# EAGLE design placa para insolar joystick (EAGLE 7.3.0)
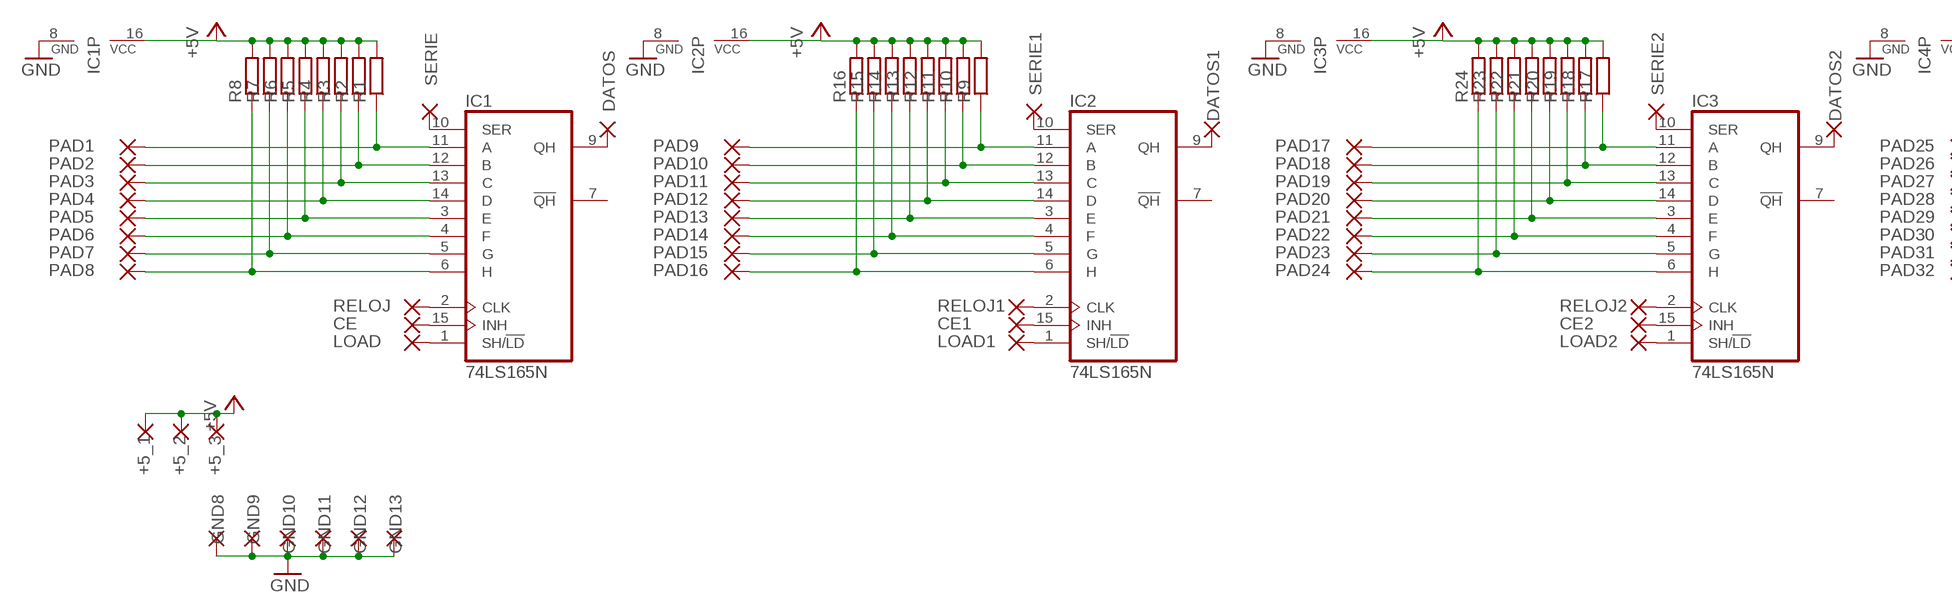
[diagram p0: schematic, sheet 1, part 1 of 2]
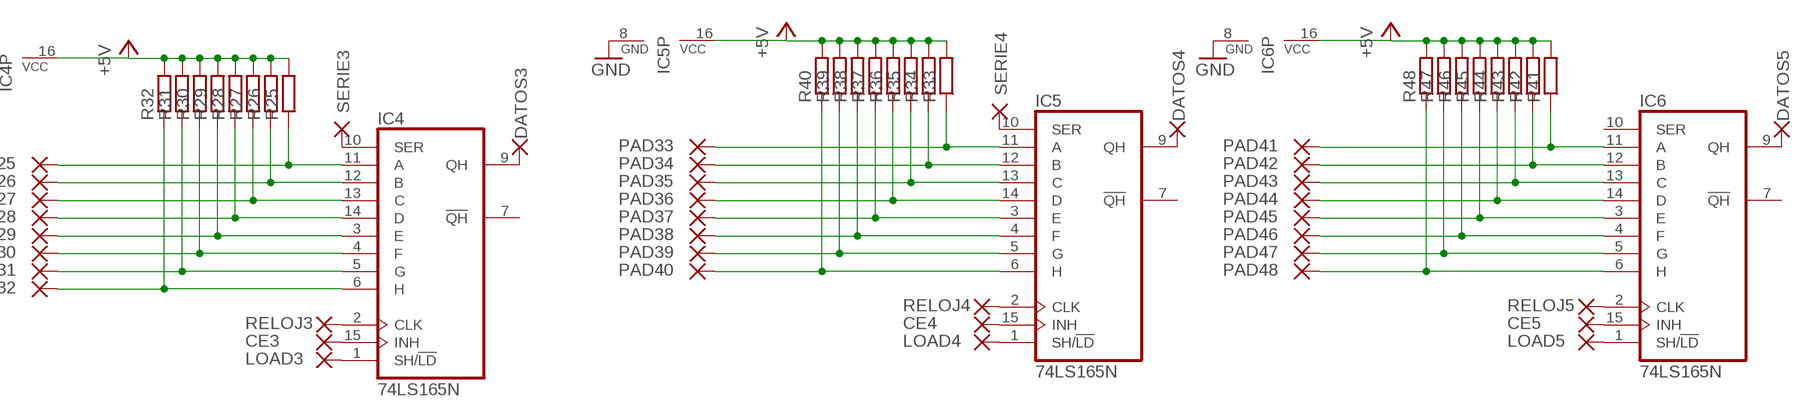
[diagram p1: schematic, sheet 1, part 2 of 2]

## Parts
+5_1  WIREPAD2,54/1,0  [2,54/1,0]
+5_2  WIREPAD2,54/1,0  [2,54/1,0]
+5_3  WIREPAD2,54/1,0  [2,54/1,0]
CE  WIREPAD2,54/1,0  [2,54/1,0]
CE1  WIREPAD2,54/1,0  [2,54/1,0]
CE2  WIREPAD2,54/1,0  [2,54/1,0]
CE3  WIREPAD2,54/1,0  [2,54/1,0]
CE4  WIREPAD2,54/1,0  [2,54/1,0]
CE5  WIREPAD2,54/1,0  [2,54/1,0]
DATOS  WIREPAD2,54/1,0  [2,54/1,0]
DATOS1  WIREPAD2,54/1,0  [2,54/1,0]
DATOS2  WIREPAD2,54/1,0  [2,54/1,0]
DATOS3  WIREPAD2,54/1,0  [2,54/1,0]
DATOS4  WIREPAD2,54/1,0  [2,54/1,0]
DATOS5  WIREPAD2,54/1,0  [2,54/1,0]
GND8  WIREPAD2,54/1,0  [2,54/1,0]
GND9  WIREPAD2,54/1,0  [2,54/1,0]
GND10  WIREPAD2,54/1,0  [2,54/1,0]
GND11  WIREPAD2,54/1,0  [2,54/1,0]
GND12  WIREPAD2,54/1,0  [2,54/1,0]
GND13  WIREPAD2,54/1,0  [2,54/1,0]
IC1  74LS165N  [DIL16]
IC2  74LS165N  [DIL16]
IC3  74LS165N  [DIL16]
IC4  74LS165N  [DIL16]
IC5  74LS165N  [DIL16]
IC6  74LS165N  [DIL16]
LOAD  WIREPAD2,54/1,0  [2,54/1,0]
LOAD1  WIREPAD2,54/1,0  [2,54/1,0]
LOAD2  WIREPAD2,54/1,0  [2,54/1,0]
LOAD3  WIREPAD2,54/1,0  [2,54/1,0]
LOAD4  WIREPAD2,54/1,0  [2,54/1,0]
LOAD5  WIREPAD2,54/1,0  [2,54/1,0]
PAD1  WIREPAD2,54/1,0  [2,54/1,0]
PAD2  WIREPAD2,54/1,0  [2,54/1,0]
PAD3  WIREPAD2,54/1,0  [2,54/1,0]
PAD4  WIREPAD2,54/1,0  [2,54/1,0]
PAD5  WIREPAD2,54/1,0  [2,54/1,0]
PAD6  WIREPAD2,54/1,0  [2,54/1,0]
PAD7  WIREPAD2,54/1,0  [2,54/1,0]
PAD8  WIREPAD2,54/1,0  [2,54/1,0]
PAD9  WIREPAD2,54/1,0  [2,54/1,0]
PAD10  WIREPAD2,54/1,0  [2,54/1,0]
PAD11  WIREPAD2,54/1,0  [2,54/1,0]
PAD12  WIREPAD2,54/1,0  [2,54/1,0]
PAD13  WIREPAD2,54/1,0  [2,54/1,0]
PAD14  WIREPAD2,54/1,0  [2,54/1,0]
PAD15  WIREPAD2,54/1,0  [2,54/1,0]
PAD16  WIREPAD2,54/1,0  [2,54/1,0]
PAD17  WIREPAD2,54/1,0  [2,54/1,0]
PAD18  WIREPAD2,54/1,0  [2,54/1,0]
PAD19  WIREPAD2,54/1,0  [2,54/1,0]
PAD20  WIREPAD2,54/1,0  [2,54/1,0]
PAD21  WIREPAD2,54/1,0  [2,54/1,0]
PAD22  WIREPAD2,54/1,0  [2,54/1,0]
PAD23  WIREPAD2,54/1,0  [2,54/1,0]
PAD24  WIREPAD2,54/1,0  [2,54/1,0]
PAD25  WIREPAD2,54/1,0  [2,54/1,0]
PAD26  WIREPAD2,54/1,0  [2,54/1,0]
PAD27  WIREPAD2,54/1,0  [2,54/1,0]
PAD28  WIREPAD2,54/1,0  [2,54/1,0]
PAD29  WIREPAD2,54/1,0  [2,54/1,0]
PAD30  WIREPAD2,54/1,0  [2,54/1,0]
PAD31  WIREPAD2,54/1,0  [2,54/1,0]
PAD32  WIREPAD2,54/1,0  [2,54/1,0]
PAD33  WIREPAD2,54/1,0  [2,54/1,0]
PAD34  WIREPAD2,54/1,0  [2,54/1,0]
PAD35  WIREPAD2,54/1,0  [2,54/1,0]
PAD36  WIREPAD2,54/1,0  [2,54/1,0]
PAD37  WIREPAD2,54/1,0  [2,54/1,0]
PAD38  WIREPAD2,54/1,0  [2,54/1,0]
PAD39  WIREPAD2,54/1,0  [2,54/1,0]
PAD40  WIREPAD2,54/1,0  [2,54/1,0]
PAD41  WIREPAD2,54/1,0  [2,54/1,0]
PAD42  WIREPAD2,54/1,0  [2,54/1,0]
PAD43  WIREPAD2,54/1,0  [2,54/1,0]
PAD44  WIREPAD2,54/1,0  [2,54/1,0]
PAD45  WIREPAD2,54/1,0  [2,54/1,0]
PAD46  WIREPAD2,54/1,0  [2,54/1,0]
PAD47  WIREPAD2,54/1,0  [2,54/1,0]
PAD48  WIREPAD2,54/1,0  [2,54/1,0]
R1  R-EU_0204/7  [0204/7]
R2  R-EU_0204/7  [0204/7]
R3  R-EU_0204/7  [0204/7]
R4  R-EU_0204/7  [0204/7]
R5  R-EU_0204/7  [0204/7]
R6  R-EU_0204/7  [0204/7]
R7  R-EU_0204/7  [0204/7]
R8  R-EU_0204/7  [0204/7]
R9  R-EU_0204/7  [0204/7]
R10  R-EU_0204/7  [0204/7]
R11  R-EU_0204/7  [0204/7]
R12  R-EU_0204/7  [0204/7]
R13  R-EU_0204/7  [0204/7]
R14  R-EU_0204/7  [0204/7]
R15  R-EU_0204/7  [0204/7]
R16  R-EU_0204/7  [0204/7]
R17  R-EU_0204/7  [0204/7]
R18  R-EU_0204/7  [0204/7]
R19  R-EU_0204/7  [0204/7]
R20  R-EU_0204/7  [0204/7]
R21  R-EU_0204/7  [0204/7]
R22  R-EU_0204/7  [0204/7]
R23  R-EU_0204/7  [0204/7]
R24  R-EU_0204/7  [0204/7]
R25  R-EU_0204/7  [0204/7]
R26  R-EU_0204/7  [0204/7]
R27  R-EU_0204/7  [0204/7]
R28  R-EU_0204/7  [0204/7]
R29  R-EU_0204/7  [0204/7]
R30  R-EU_0204/7  [0204/7]
R31  R-EU_0204/7  [0204/7]
R32  R-EU_0204/7  [0204/7]
R33  R-EU_0204/7  [0204/7]
R34  R-EU_0204/7  [0204/7]
R35  R-EU_0204/7  [0204/7]
R36  R-EU_0204/7  [0204/7]
R37  R-EU_0204/7  [0204/7]
R38  R-EU_0204/7  [0204/7]
R39  R-EU_0204/7  [0204/7]
R40  R-EU_0204/7  [0204/7]
R41  R-EU_0204/7  [0204/7]
R42  R-EU_0204/7  [0204/7]
R43  R-EU_0204/7  [0204/7]
R44  R-EU_0204/7  [0204/7]
R45  R-EU_0204/7  [0204/7]
R46  R-EU_0204/7  [0204/7]
R47  R-EU_0204/7  [0204/7]
R48  R-EU_0204/7  [0204/7]
RELOJ  WIREPAD2,54/1,0  [2,54/1,0]
RELOJ1  WIREPAD2,54/1,0  [2,54/1,0]
RELOJ2  WIREPAD2,54/1,0  [2,54/1,0]
RELOJ3  WIREPAD2,54/1,0  [2,54/1,0]
RELOJ4  WIREPAD2,54/1,0  [2,54/1,0]
RELOJ5  WIREPAD2,54/1,0  [2,54/1,0]
SERIE  WIREPAD2,54/1,0  [2,54/1,0]
SERIE1  WIREPAD2,54/1,0  [2,54/1,0]
SERIE2  WIREPAD2,54/1,0  [2,54/1,0]
SERIE3  WIREPAD2,54/1,0  [2,54/1,0]
SERIE4  WIREPAD2,54/1,0  [2,54/1,0]

## Nets
+5V: +5_1.1(P) +5_2.1(P) +5_3.1(P) IC1.16(VCC) IC2.16(VCC) IC3.16(VCC) IC4.16(VCC) IC5.16(VCC) IC6.16(VCC) R1.2 R2.2 R3.2 R4.2 R5.2 R6.2 R7.2 R8.2 R9.2 R10.2 R11.2 R12.2 R13.2 R14.2 R15.2 R16.2 R17.2 R18.2 R19.2 R20.2 R21.2 R22.2 R23.2 R24.2 R25.2 R26.2 R27.2 R28.2 R29.2 R30.2 R31.2 R32.2 R33.2 R34.2 R35.2 R36.2 R37.2 R38.2 R39.2 R40.2 R41.2 R42.2 R43.2 R44.2 R45.2 R46.2 R47.2 R48.2
GND: GND8.1(P) GND9.1(P) GND10.1(P) GND11.1(P) GND12.1(P) GND13.1(P) IC1.8(GND) IC2.8(GND) IC3.8(GND) IC4.8(GND) IC5.8(GND) IC6.8(GND)
N$1: IC1.11(A) PAD1.1(P) R1.1
N$2: IC1.12(B) PAD2.1(P) R2.1
N$3: IC1.13(C) PAD3.1(P) R3.1
N$4: IC1.14(D) PAD4.1(P) R4.1
N$5: IC1.3(E) PAD5.1(P) R5.1
N$6: IC1.4(F) PAD6.1(P) R6.1
N$7: IC1.5(G) PAD7.1(P) R7.1
N$8: IC1.6(H) PAD8.1(P) R8.1
N$9: IC2.11(A) PAD9.1(P) R9.1
N$10: IC2.12(B) PAD10.1(P) R10.1
N$11: IC2.13(C) PAD11.1(P) R11.1
N$12: IC2.14(D) PAD12.1(P) R12.1
N$13: IC2.3(E) PAD13.1(P) R13.1
N$14: IC2.4(F) PAD14.1(P) R14.1
N$15: IC2.5(G) PAD15.1(P) R15.1
N$16: IC2.6(H) PAD16.1(P) R16.1
N$17: IC3.11(A) PAD17.1(P) R17.1
N$18: IC3.12(B) PAD18.1(P) R18.1
N$19: IC3.13(C) PAD19.1(P) R19.1
N$20: IC3.14(D) PAD20.1(P) R20.1
N$21: IC3.3(E) PAD21.1(P) R21.1
N$22: IC3.4(F) PAD22.1(P) R22.1
N$23: IC3.5(G) PAD23.1(P) R23.1
N$24: IC3.6(H) PAD24.1(P) R24.1
N$25: IC4.11(A) PAD25.1(P) R25.1
N$26: IC4.12(B) PAD26.1(P) R26.1
N$27: IC4.13(C) PAD27.1(P) R27.1
N$28: IC4.14(D) PAD28.1(P) R28.1
N$29: IC4.3(E) PAD29.1(P) R29.1
N$30: IC4.4(F) PAD30.1(P) R30.1
N$31: IC4.5(G) PAD31.1(P) R31.1
N$32: IC4.6(H) PAD32.1(P) R32.1
N$33: IC5.11(A) PAD33.1(P) R33.1
N$34: IC5.12(B) PAD34.1(P) R34.1
N$35: IC5.13(C) PAD35.1(P) R35.1
N$36: IC5.14(D) PAD36.1(P) R36.1
N$37: IC5.3(E) PAD37.1(P) R37.1
N$38: IC5.4(F) PAD38.1(P) R38.1
N$39: IC5.5(G) PAD39.1(P) R39.1
N$40: IC5.6(H) PAD40.1(P) R40.1
N$41: IC6.11(A) PAD41.1(P) R41.1
N$42: IC6.12(B) PAD42.1(P) R42.1
N$43: IC6.13(C) PAD43.1(P) R43.1
N$44: IC6.14(D) PAD44.1(P) R44.1
N$45: IC6.3(E) PAD45.1(P) R45.1
N$46: IC6.4(F) PAD46.1(P) R46.1
N$47: IC6.5(G) PAD47.1(P) R47.1
N$48: IC6.6(H) PAD48.1(P) R48.1
N$49: IC1.2(CLK) RELOJ.1(P)
N$50: CE.1(P) IC1.15(INH)
N$51: IC1.1(SH/!LD) LOAD.1(P)
N$52: IC2.2(CLK) RELOJ1.1(P)
N$53: CE1.1(P) IC2.15(INH)
N$54: IC2.1(SH/!LD) LOAD1.1(P)
N$55: IC3.2(CLK) RELOJ2.1(P)
N$56: CE2.1(P) IC3.15(INH)
N$57: IC3.1(SH/!LD) LOAD2.1(P)
N$58: IC4.2(CLK) RELOJ3.1(P)
N$59: CE3.1(P) IC4.15(INH)
N$60: IC4.1(SH/!LD) LOAD3.1(P)
N$61: IC5.2(CLK) RELOJ4.1(P)
N$62: CE4.1(P) IC5.15(INH)
N$63: IC5.1(SH/!LD) LOAD4.1(P)
N$64: IC6.2(CLK) RELOJ5.1(P)
N$65: CE5.1(P) IC6.15(INH)
N$66: IC6.1(SH/!LD) LOAD5.1(P)
N$67: DATOS5.1(P) IC6.9(QH)
N$68: IC5.10(SER) SERIE4.1(P)
N$69: DATOS4.1(P) IC5.9(QH)
N$70: DATOS3.1(P) IC4.9(QH)
N$71: IC4.10(SER) SERIE3.1(P)
N$72: DATOS2.1(P) IC3.9(QH)
N$73: IC3.10(SER) SERIE2.1(P)
N$74: DATOS1.1(P) IC2.9(QH)
N$75: IC2.10(SER) SERIE1.1(P)
N$76: DATOS.1(P) IC1.9(QH)
N$77: IC1.10(SER) SERIE.1(P)
Unconnected: IC1.7(!QH) IC2.7(!QH) IC3.7(!QH) IC4.7(!QH) IC5.7(!QH) IC6.7(!QH) IC6.10(SER)

## Library data of the parts
+5_1-+5_3 CE CE1-CE5 DATOS DATOS1-DATOS5 GND8-GND13 LOAD LOAD1-LOAD5 PAD1-PAD48 RELOJ RELOJ1-RELOJ5 SERIE SERIE1-SERIE4 = wirepad:WIREPAD: Wire PAD connect wire on PCB
IC1-IC6 = 74xx-eu:74*165: 8-bit parallel load SHIFT REGISTER
R1-R48 = rcl:R-EU_: RESISTOR, European symbol

## Board
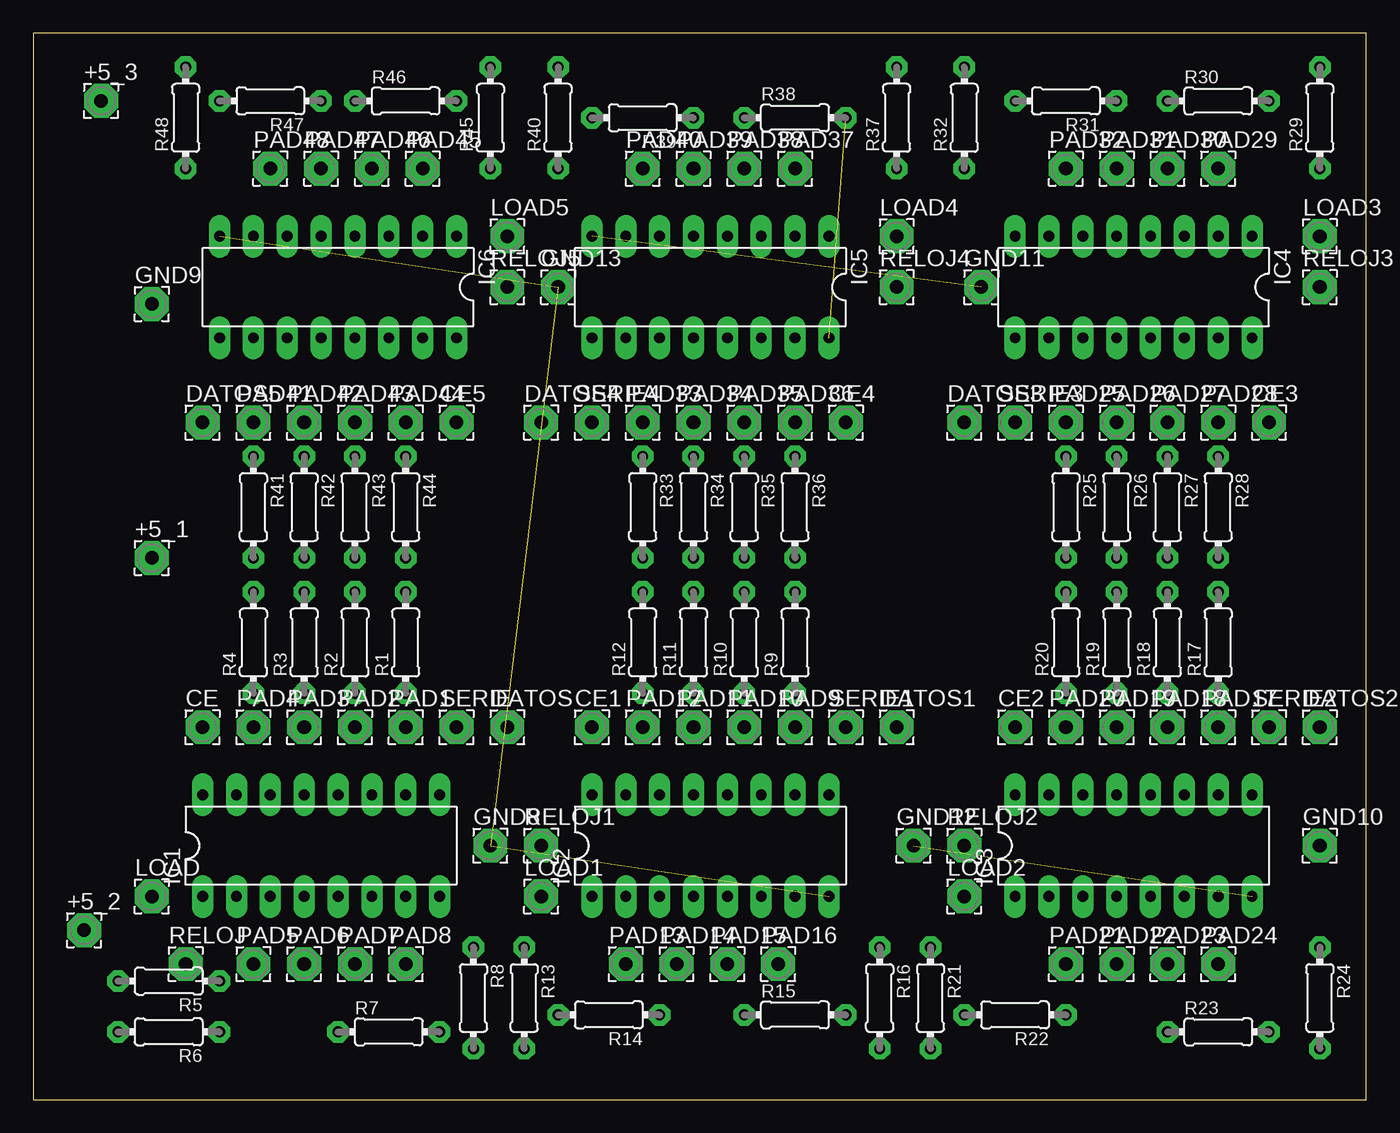
[diagram p2: board, top side]
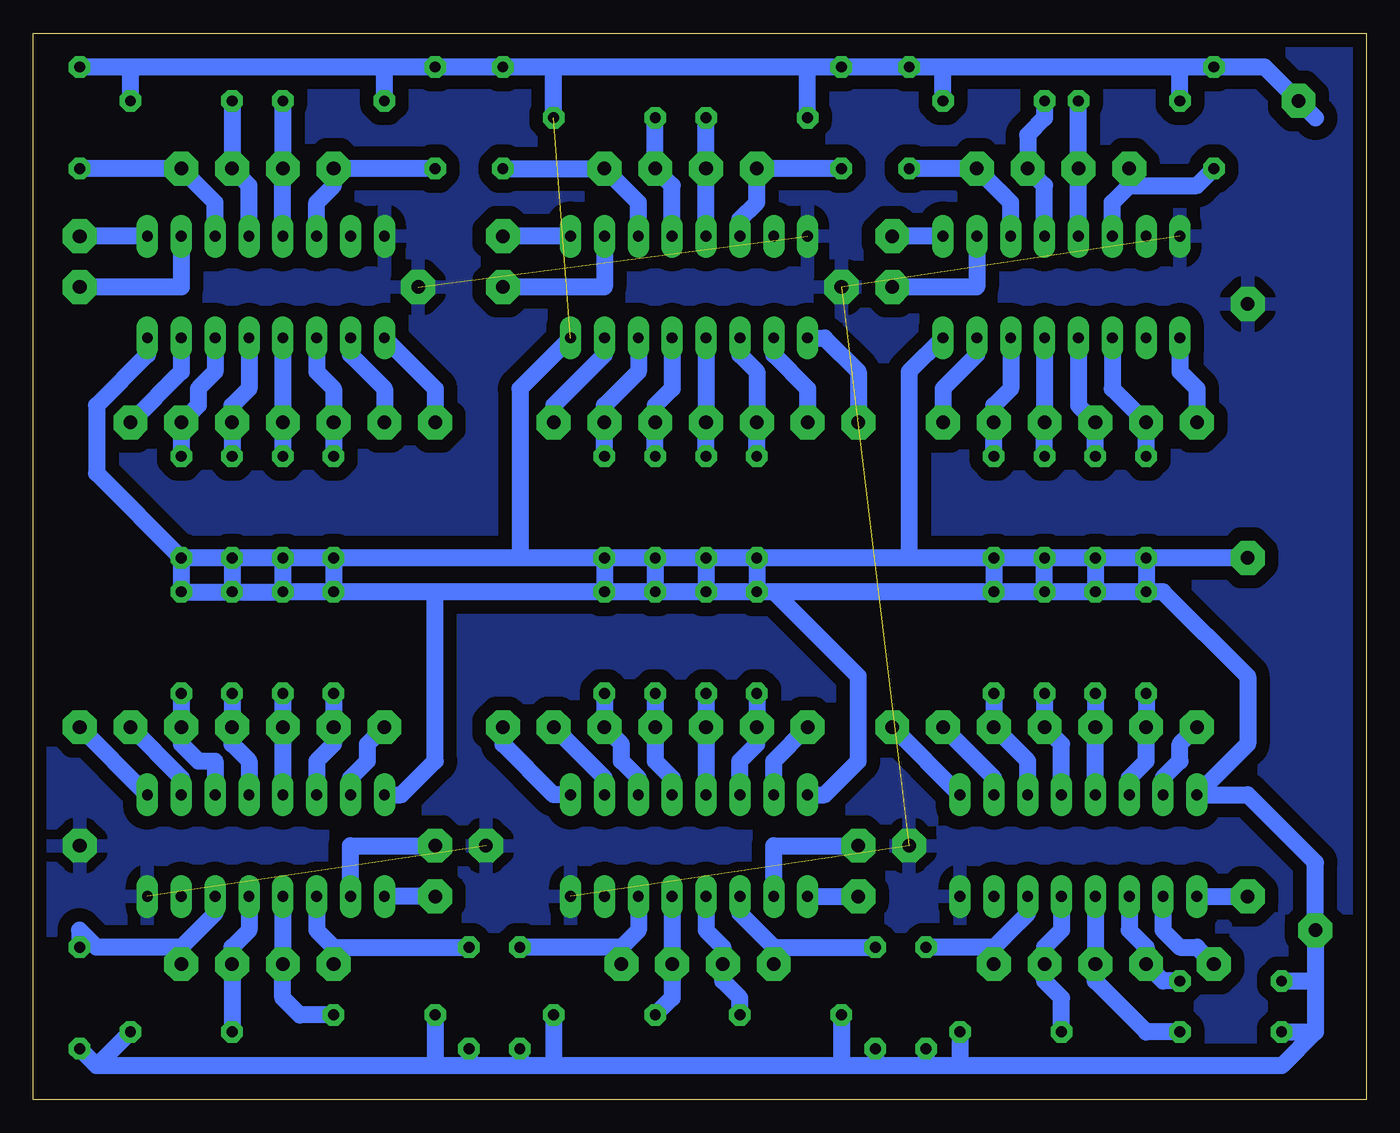
[diagram p3: board, bottom side, seen from below]

Size 100 x 80 mm. Coordinates in mm from the lower left corner, seen from the top.
Outline: 0,0 100,0 100,80 0,80 0,0
Copper layers (1*16): Top 0.035mm / dielectric 1.5mm / Bottom 0.035mm
Design rules "reglas para insolar": minimum track width 1mm, minimum drill 0.6mm, track to track 0.8mm, track to pad 0.8mm, pad to pad 0.8mm, via to via 0.8mm, smd to smd 0.8mm, copper to edge 0.8mm, drill to drill 0.8mm, minimum pad ring 0.4mm, minimum via ring 0.4mm, stop-mask expansion 4mil, vias tented up to drill 0mil, thermal gap 0.8mm

### Footprints (pad centres in the part's own frame; a part is rotated, then mirrored left to right if it is on the bottom)
2,54/1,0 = drill 1.016 pad 2.54 octagon: 1 0,0
DIL16 = drill 0.813 long: 1 -8.89,-3.81; 2 -6.35,-3.81; 3 -3.81,-3.81; 4 -1.27,-3.81; 5 1.27,-3.81; 6 3.81,-3.81; 7 6.35,-3.81; 8 8.89,-3.81; 9 8.89,3.81; 10 6.35,3.81; 11 3.81,3.81; 12 1.27,3.81; 13 -1.27,3.81; 14 -3.81,3.81; 15 -6.35,3.81; 16 -8.89,3.81
0204/7 = drill 0.813 octagon: 1 -3.81,0; 2 3.81,0

### Placement (x,y rotation side)
+5_1  8.89,40.64 0 top
+5_2  3.81,12.7 0 top
+5_3  5.08,74.93 0 top
CE  12.7,27.94 0 top
CE1  41.91,27.94 0 top
CE2  73.66,27.94 0 top
CE3  92.71,50.8 0 top
CE4  60.96,50.8 0 top
CE5  31.75,50.8 0 top
DATOS  35.56,27.94 0 top
DATOS1  64.77,27.94 0 top
DATOS2  96.52,27.94 0 top
DATOS3  69.85,50.8 0 top
DATOS4  38.1,50.8 0 top
DATOS5  12.7,50.8 0 top
GND8  34.29,19.05 0 top
GND9  8.89,59.69 0 top
GND10  96.52,19.05 0 top
GND11  71.12,60.96 0 top
GND12  66.04,19.05 0 top
GND13  39.37,60.96 0 top
IC1  21.59,19.05 0 top
IC2  50.8,19.05 0 top
IC3  82.55,19.05 0 top
IC4  82.55,60.96 180 top
IC5  50.8,60.96 180 top
IC6  22.86,60.96 180 top
LOAD  8.89,15.24 0 top
LOAD1  38.1,15.24 0 top
LOAD2  69.85,15.24 0 top
LOAD3  96.52,64.77 0 top
LOAD4  64.77,64.77 0 top
LOAD5  35.56,64.77 0 top
PAD1  27.94,27.94 0 top
PAD2  24.13,27.94 0 top
PAD3  20.32,27.94 0 top
PAD4  16.51,27.94 0 top
PAD5  16.51,10.16 0 top
PAD6  20.32,10.16 0 top
PAD7  24.13,10.16 0 top
PAD8  27.94,10.16 0 top
PAD9  57.15,27.94 0 top
PAD10  53.34,27.94 0 top
PAD11  49.53,27.94 0 top
PAD12  45.72,27.94 0 top
PAD13  44.45,10.16 0 top
PAD14  48.26,10.16 0 top
PAD15  52.07,10.16 0 top
PAD16  55.88,10.16 0 top
PAD17  88.9,27.94 0 top
PAD18  85.09,27.94 0 top
PAD19  81.28,27.94 0 top
PAD20  77.47,27.94 0 top
PAD21  77.47,10.16 0 top
PAD22  81.28,10.16 0 top
PAD23  85.09,10.16 0 top
PAD24  88.9,10.16 0 top
PAD25  77.47,50.8 0 top
PAD26  81.28,50.8 0 top
PAD27  85.09,50.8 0 top
PAD28  88.9,50.8 0 top
PAD29  88.9,69.85 0 top
PAD30  85.09,69.85 0 top
PAD31  81.28,69.85 0 top
PAD32  77.47,69.85 0 top
PAD33  45.72,50.8 0 top
PAD34  49.53,50.8 0 top
PAD35  53.34,50.8 0 top
PAD36  57.15,50.8 0 top
PAD37  57.15,69.85 0 top
PAD38  53.34,69.85 0 top
PAD39  49.53,69.85 0 top
PAD40  45.72,69.85 0 top
PAD41  16.51,50.8 0 top
PAD42  20.32,50.8 0 top
PAD43  24.13,50.8 0 top
PAD44  27.94,50.8 0 top
PAD45  29.21,69.85 0 top
PAD46  25.4,69.85 0 top
PAD47  21.59,69.85 0 top
PAD48  17.78,69.85 0 top
R1  27.94,34.29 90 top
R2  24.13,34.29 90 top
R3  20.32,34.29 90 top
R4  16.51,34.29 90 top
R5  10.16,8.89 180 top
R6  10.16,5.08 180 top
R7  26.67,5.08 0 top
R8  33.02,7.62 270 top
R9  57.15,34.29 90 top
R10  53.34,34.29 90 top
R11  49.53,34.29 90 top
R12  45.72,34.29 90 top
R13  36.83,7.62 270 top
R14  43.18,6.35 180 top
R15  57.15,6.35 0 top
R16  63.5,7.62 270 top
R17  88.9,34.29 90 top
R18  85.09,34.29 90 top
R19  81.28,34.29 90 top
R20  77.47,34.29 90 top
R21  67.31,7.62 270 top
R22  73.66,6.35 180 top
R23  88.9,5.08 0 top
R24  96.52,7.62 270 top
R25  77.47,44.45 270 top
R26  81.28,44.45 270 top
R27  85.09,44.45 270 top
R28  88.9,44.45 270 top
R29  96.52,73.66 90 top
R30  88.9,74.93 0 top
R31  77.47,74.93 180 top
R32  69.85,73.66 90 top
R33  45.72,44.45 270 top
R34  49.53,44.45 270 top
R35  53.34,44.45 270 top
R36  57.15,44.45 270 top
R37  64.77,73.66 90 top
R38  57.15,73.66 0 top
R39  45.72,73.66 180 top
R40  39.37,73.66 90 top
R41  16.51,44.45 270 top
R42  20.32,44.45 270 top
R43  24.13,44.45 270 top
R44  27.94,44.45 270 top
R45  34.29,73.66 90 top
R46  27.94,74.93 0 top
R47  17.78,74.93 180 top
R48  11.43,73.66 90 top
RELOJ  11.43,10.16 0 top
RELOJ1  38.1,19.05 0 top
RELOJ2  69.85,19.05 0 top
RELOJ3  96.52,60.96 0 top
RELOJ4  64.77,60.96 0 top
RELOJ5  35.56,60.96 0 top
SERIE  31.75,27.94 0 top
SERIE1  60.96,27.94 0 top
SERIE2  92.71,27.94 0 top
SERIE3  73.66,50.8 0 top
SERIE4  41.91,50.8 0 top

### Tracks (layer width: path | path; a pad name or v marks a point on that pad's centre or on a via)
+5V  (1 unrouted)
  Bottom 1.27: R41.2 R42.2 | R42.2 R43.2 | R43.2 R44.2 | R44.2 34.29,40.64 | 34.29,40.64 R33.2 | R33.2 R34.2 | R34.2 R35.2 | R35.2 R36.2 | R36.2 63.5,40.64 | 63.5,40.64 R25.2 | R25.2 R26.2 | R26.2 R27.2 | R27.2 R28.2 | +5_1.1 R41.2 | R41.2 R4.2 | R42.2 R3.2 | R3.2 R2.2 R43.2 | R4.2 R3.2 | R3.2 R1.2 | R1.2 44.45,38.1 | 44.45,38.1 R12.2 | R12.2 R11.2 | R11.2 R10.2 | R10.2 R9.2 | R9.2 69.85,38.1 | 69.85,38.1 R20.2 | R20.2 R19.2 | R18.2 R19.2 | R18.2 R17.2 R28.2 | R44.2 R1.2 | R33.2 R12.2 | R34.2 R11.2 | R35.2 R10.2 | R36.2 R9.2 | R25.2 R20.2 | R26.2 R19.2 | R27.2 R18.2 | 3.81,8.89 +5_2.1 3.81,17.78 8.89,22.86 IC1.16 8.89,26.67 8.89,31.75 15.24,38.1 R4.2 | 3.81,8.89 3.81,5.08 | 3.81,5.08 6.35,2.54 30.48,2.54 | 30.48,2.54 33.02,2.54 | 33.02,2.54 36.83,2.54 | 36.83,2.54 39.37,2.54 | 39.37,2.54 60.96,2.54 | 60.96,2.54 63.5,2.54 | 63.5,2.54 67.31,2.54 | 67.31,2.54 69.85,2.54 | 69.85,2.54 95.25,2.54 | 95.25,2.54 R24.2 | R5.2 3.81,8.89 | R6.2 3.81,5.08 | R23.2 95.25,2.54 | R22.2 69.85,2.54 | R21.2 67.31,2.54 | R16.2 63.5,2.54 | R15.2 60.96,2.54 | R14.2 39.37,2.54 | R13.2 36.83,2.54 | R8.2 33.02,2.54 | R7.2 30.48,2.54 | 13.97,77.47 R48.2 7.62,77.47 +5_3.1 3.81,73.66 | 13.97,77.47 31.75,77.47 | 31.75,77.47 R45.2 R40.2 41.91,77.47 | 41.91,77.47 60.96,77.47 | 60.96,77.47 R37.2 R32.2 73.66,77.47 | 73.66,77.47 92.71,77.47 | 92.71,77.47 R29.2 | R30.2 92.71,77.47 | R31.2 73.66,77.47 | R39.2 41.91,77.47 | R38.2 60.96,77.47 | R46.2 31.75,77.47 | R47.2 13.97,77.47 | IC5.16 63.5,53.34 63.5,40.64 | IC4.16 91.44,55.88 95.25,52.07 95.25,46.99 R28.2 | IC2.16 40.64,22.86 38.1,25.4 38.1,31.75 44.45,38.1 | IC3.16 72.39,22.86 69.85,25.4 69.85,38.1 | IC6.16 34.29,54.61 34.29,40.64
GND  (5 unrouted)
  pour Bottom (isolate 1.016): 0,0 100.33,0 100.33,80.01 0,80.01
N$1
  Bottom 1.27: IC1.11 25.4,25.4 PAD1.1 R1.1
N$2
  Bottom 1.27: IC1.12 22.86,26.67 PAD2.1 R2.1
N$3
  Bottom 1.27: IC1.13 PAD3.1 R3.1
N$4
  Bottom 1.27: IC1.14 17.78,24.13 16.51,25.4 PAD4.1 R4.1
N$5
  Bottom 1.27: IC1.3 17.78,12.7 16.51,11.43 PAD5.1 15.24,8.89 R5.1
N$6
  Bottom 1.27: IC1.4 PAD6.1 20.32,8.89 16.51,5.08 R6.1
N$7
  Bottom 1.27: IC1.5 22.86,12.7 24.13,11.43 PAD7.1 24.13,8.89 22.86,7.62 R7.1
N$8
  Bottom 1.27: IC1.6 25.4,13.97 27.94,11.43 | 27.94,11.43 PAD8.1 | 27.94,11.43 R8.1
N$9
  Bottom 1.27: IC2.11 54.61,24.13 55.88,25.4 55.88,26.67 PAD9.1 R9.1
N$10
  Bottom 1.27: IC2.12 52.07,24.13 53.34,25.4 PAD10.1 R10.1
N$11
  Bottom 1.27: IC2.13 PAD11.1 R11.1
N$12
  Bottom 1.27: IC2.14 46.99,25.4 45.72,26.67 PAD12.1 R12.1
N$13
  Bottom 1.27: IC2.3 46.99,13.97 44.45,11.43 | 44.45,11.43 PAD13.1 | 44.45,11.43 R13.1
N$14
  Bottom 1.27: IC2.4 49.53,12.7 48.26,11.43 PAD14.1 48.26,8.89 46.99,7.62 R14.1
N$15
  Bottom 1.27: IC2.5 PAD15.1 52.07,7.62 R15.1
N$16
  Bottom 1.27: IC2.6 54.61,12.7 55.88,11.43 | 55.88,11.43 PAD16.1 | 55.88,11.43 R16.1
N$17
  Bottom 1.27: IC3.11 86.36,25.4 87.63,25.4 88.9,26.67 PAD17.1 R17.1
N$18
  Bottom 1.27: IC3.12 83.82,25.4 85.09,26.67 PAD18.1 R18.1
N$19
  Bottom 1.27: IC3.13 PAD19.1 R19.1
N$20
  Bottom 1.27: IC3.14 78.74,25.4 77.47,26.67 PAD20.1 R20.1
N$21
  Bottom 1.27: IC3.3 78.74,12.7 77.47,11.43 | 77.47,11.43 PAD21.1 | 77.47,11.43 R21.1
N$22
  Bottom 1.27: IC3.4 PAD22.1 81.28,7.62 80.01,6.35 R22.1
N$23
  Bottom 1.27: IC3.5 83.82,12.7 85.09,11.43 PAD23.1 R23.1
N$24
  Bottom 1.27: IC3.6 86.36,13.97 88.9,11.43 | 88.9,11.43 PAD24.1 | 88.9,11.43 95.25,11.43 96.52,12.7 R24.1
N$25
  Bottom 1.27: IC4.11 78.74,54.61 77.47,53.34 PAD25.1 R25.1
N$26
  Bottom 1.27: IC4.12 PAD26.1 R26.1
N$27
  Bottom 1.27: IC4.13 83.82,53.34 85.09,52.07 PAD27.1 R27.1
N$28
  Bottom 1.27: IC4.14 86.36,54.61 87.63,53.34 87.63,52.07 PAD28.1 R28.1
N$29
  Bottom 1.27: IC4.3 86.36,67.31 PAD29.1 R29.1
N$30
  Bottom 1.27: IC4.4 83.82,68.58 PAD30.1 R30.1
N$31
  Bottom 1.27: IC4.5 PAD31.1 R31.1
N$32
  Bottom 1.27: IC4.6 78.74,67.31 77.47,68.58 PAD32.1 R32.1
N$33
  Bottom 1.27: IC5.11 46.99,55.88 45.72,54.61 PAD33.1 R33.1
N$34
  Bottom 1.27: IC5.12 PAD34.1 R34.1
N$35
  Bottom 1.27: IC5.13 52.07,53.34 53.34,52.07 PAD35.1 R35.1
N$36
  Bottom 1.27: IC5.14 54.61,54.61 57.15,52.07 PAD36.1 R36.1
N$37
  Bottom 1.27: IC5.3 54.61,67.31 PAD37.1 R37.1
N$38
  Bottom 1.27: IC5.4 52.07,68.58 PAD38.1 R38.1
N$39
  Bottom 1.27: IC5.5 PAD39.1 R39.1
N$40
  Bottom 1.27: IC5.6 46.99,66.04 45.72,67.31 PAD40.1 R40.1
N$41
  Bottom 1.27: IC6.11 19.05,53.34 PAD41.1 R41.1
N$42
  Bottom 1.27: IC6.12 21.59,52.07 PAD42.1 R42.1
N$43
  Bottom 1.27: IC6.13 PAD43.1 R43.1
N$44
  Bottom 1.27: IC6.14 26.67,53.34 27.94,52.07 PAD44.1 R44.1
N$45
  Bottom 1.27: IC6.3 26.67,67.31 PAD45.1 R45.1
N$46
  Bottom 1.27: IC6.4 24.13,68.58 PAD46.1 25.4,72.39 24.13,73.66 R46.1
N$47
  Bottom 1.27: IC6.5 PAD47.1 R47.1
N$48
  Bottom 1.27: IC6.6 19.05,67.31 17.78,68.58 | 17.78,68.58 PAD48.1 | 17.78,68.58 12.7,68.58 R48.1
N$49
  Bottom 1.27: IC1.2 15.24,12.7 13.97,11.43 12.7,11.43 RELOJ.1
N$50
  Bottom 1.27: IC1.15 15.24,24.13 13.97,25.4 13.97,26.67 CE.1
N$51
  Bottom 1.27: IC1.1 LOAD.1
N$52
  Bottom 1.27: IC2.2 44.45,19.05 RELOJ1.1
N$53
  Bottom 1.27: IC2.15 44.45,25.4 CE1.1
N$54
  Bottom 1.27: IC2.1 LOAD1.1
N$55
  Bottom 1.27: IC3.2 76.2,19.05 RELOJ2.1
N$56
  Bottom 1.27: IC3.15 76.2,24.13 74.93,25.4 74.93,26.67 CE2.1
N$57
  Bottom 1.27: LOAD2.1 IC3.1
N$58
  Bottom 1.27: IC4.2 88.9,60.96 RELOJ3.1
N$59
  Bottom 1.27: IC4.15 88.9,54.61 CE3.1
N$60
  Bottom 1.27: IC4.1 LOAD3.1
N$61
  Bottom 1.27: IC5.2 57.15,60.96 RELOJ4.1
N$62
  Bottom 1.27: IC5.15 57.15,55.88 60.96,52.07 CE4.1
N$63
  Bottom 1.27: IC5.1 LOAD4.1
N$64
  Bottom 1.27: IC6.2 29.21,60.96 RELOJ5.1
N$65
  Bottom 1.27: IC6.15 29.21,55.88 31.75,53.34 CE5.1
N$66
  Bottom 1.27: IC6.1 LOAD5.1
N$67
  Bottom 1.27: IC6.9 13.97,54.61 12.7,53.34 DATOS5.1
N$68
  Bottom 1.27: IC5.10 44.45,55.88 41.91,53.34 SERIE4.1
N$69
  Bottom 1.27: IC5.9 40.64,57.15 38.1,54.61 DATOS4.1
N$70
  Bottom 1.27: IC4.9 69.85,53.34 DATOS3.1
N$71
  Bottom 1.27: IC4.10 76.2,55.88 73.66,53.34 SERIE3.1
N$72
  Bottom 1.27: IC3.9 DATOS2.1
N$73
  Bottom 1.27: IC3.10 88.9,24.13 SERIE2.1
N$74
  Bottom 1.27: IC2.9 60.96,22.86 64.77,26.67 DATOS1.1
N$75
  Bottom 1.27: IC2.10 57.15,24.13 SERIE1.1
N$76
  Bottom 1.27: IC1.9 DATOS.1
N$77
  Bottom 1.27: IC1.10 27.94,24.13 SERIE.1